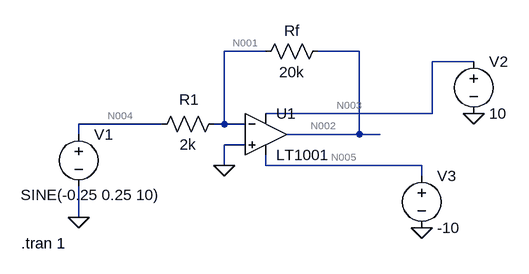
[diagram p0: schematic circuito_2_10-5_inv.asc]
circuito_2_10-5_inv.asc, the LTspice schematic file:
Version 4
SHEET 1 904 680
WIRE 240 16 176 16
WIRE 384 16 320 16
WIRE 560 32 496 32
WIRE 496 112 496 32
WIRE 496 112 240 112
WIRE 80 128 -48 128
WIRE 176 128 176 16
WIRE 176 128 160 128
WIRE 208 128 176 128
WIRE -48 144 -48 128
WIRE 384 144 384 16
WIRE 384 144 272 144
WIRE 416 144 384 144
WIRE 208 160 176 160
WIRE 176 192 176 160
WIRE 240 192 240 176
WIRE 480 192 240 192
WIRE 480 208 480 192
WIRE -48 272 -48 224
FLAG 176 192 0
FLAG -48 272 0
FLAG 560 112 0
FLAG 480 288 0
SYMBOL res 176 112 R90
WINDOW 0 -6 54 VBottom 2
WINDOW 3 32 56 VTop 2
SYMATTR InstName R1
SYMATTR Value 2k
SYMBOL voltage -48 128 R0
WINDOW 3 -89 109 Left 2
WINDOW 123 0 0 Left 2
WINDOW 39 0 0 Left 2
SYMATTR Value SINE(-0.25 0.25 10)
SYMATTR InstName V1
SYMBOL res 336 0 R90
WINDOW 0 0 56 VBottom 2
WINDOW 3 32 56 VTop 2
SYMATTR InstName Rf
SYMATTR Value 20k
SYMBOL voltage 560 16 R0
WINDOW 123 0 0 Left 2
WINDOW 39 0 0 Left 2
SYMATTR InstName V2
SYMATTR Value 10
SYMBOL Opamps\\LT1001 240 80 R0
SYMATTR InstName U1
SYMBOL voltage 480 192 R0
WINDOW 123 0 0 Left 2
WINDOW 39 0 0 Left 2
SYMATTR InstName V3
SYMATTR Value -10
TEXT -136 312 Left 2 !.tran 1

The netlist it stands for:
* circuito_2_10-5_inv.asc
R1 N001 N004 2k
V1 N004 0 SINE(-0.25 0.25 10)
Rf N002 N001 20k
V2 N003 0 10
XU1 0 N001 N003 N005 N002 LT1001  ; pins In+ In- V+ V- OUT
V3 N005 0 -10
.tran 1
.lib LTC.lib
.backanno
.end

* Results of the author's LTspice run, read from the files saved beside the schematic
* Operating Point, zero values left out:
*   V(n001) = -3.355 µV
*   V(n004) = -250 mV
*   V(n002) = 2.5 V
*   V(n003) = 10 V
*   V(n005) = -10 V
*   I(Rf) = 125 µA
*   I(R1) = 125 µA
*   I(V3) = 2.188 mA
*   I(V2) = -2.313 mA
*   I(V1) = 125 µA
*   Ix(u1:3) = 2.313 mA
*   Ix(u1:4) = -2.188 mA
*   Ix(u1:5) = -125 µA
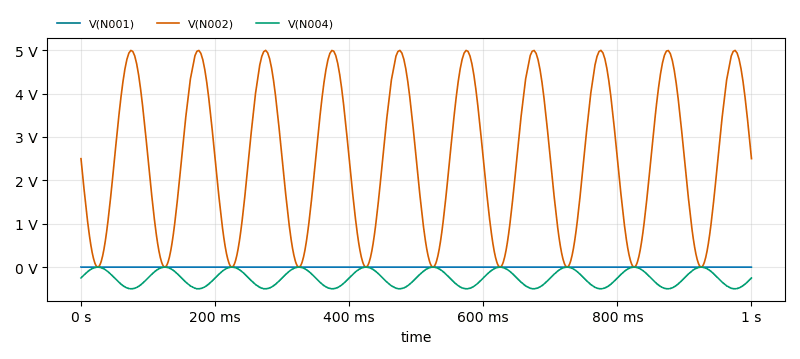
[diagram p1: Transient Analysis of circuito_2_10-5_inv.asc, plotted from the saved traces]
* Transient Analysis, 1 run:
*   V(N001): min -32.89 µV, max 31.19 µV, average -3.342 µV, rms 21.08 µV, last 26.02 µV
*   V(N002): min 2.376 mV, max 4.997 V, average 2.496 V, rms 3.061 V, last 2.5 V
*   V(N004): min -499.7 mV, max -237.8 µV, average -249.6 mV, rms 306.1 mV, last -250 mV